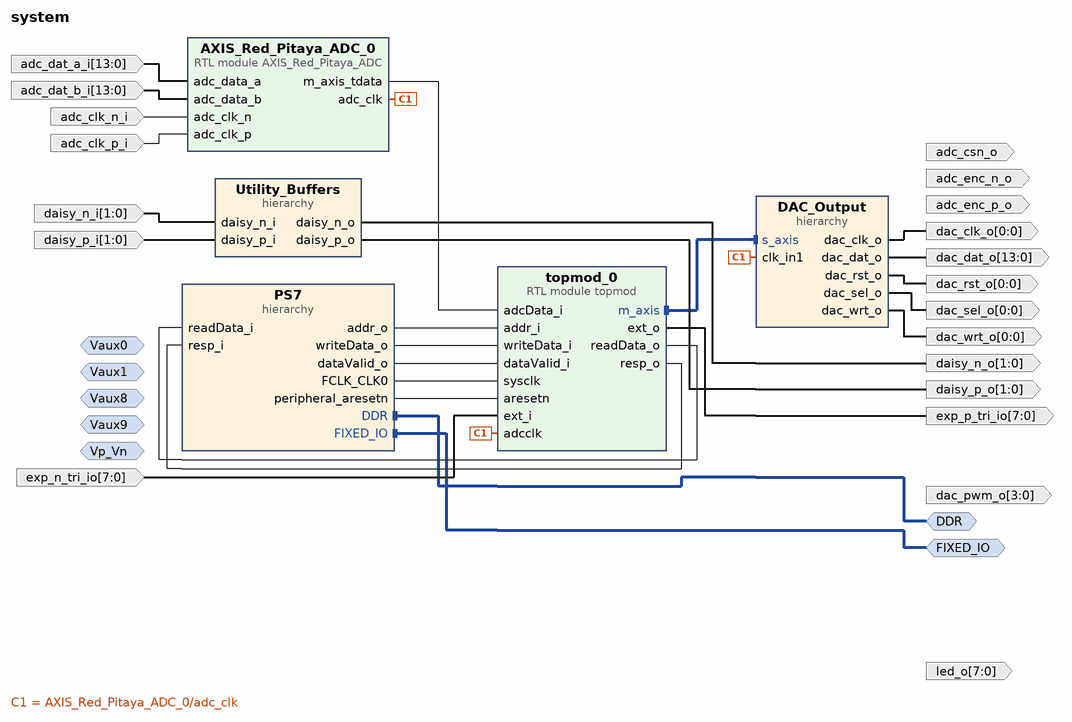
[diagram p0: block diagram of the top level]
# Vivado block design system, xc7z010clg400-1, Vivado 2020.2
create_bd_design system

create_bd_intf_port -mode Slave -vlnv xilinx.com:interface:diff_analog_io_rtl:1.0 Vp_Vn
create_bd_intf_port -mode Slave -vlnv xilinx.com:interface:diff_analog_io_rtl:1.0 Vaux0
create_bd_intf_port -mode Slave -vlnv xilinx.com:interface:diff_analog_io_rtl:1.0 Vaux1
create_bd_intf_port -mode Slave -vlnv xilinx.com:interface:diff_analog_io_rtl:1.0 Vaux9
create_bd_intf_port -mode Slave -vlnv xilinx.com:interface:diff_analog_io_rtl:1.0 Vaux8
create_bd_intf_port -mode Master -vlnv xilinx.com:interface:ddrx_rtl:1.0 DDR
create_bd_intf_port -mode Master -vlnv xilinx.com:display_processing_system7:fixedio_rtl:1.0 FIXED_IO
create_bd_port -dir I -from 13 -to 0 adc_dat_a_i
create_bd_port -dir I -from 13 -to 0 adc_dat_b_i
create_bd_port -dir I adc_clk_p_i
create_bd_port -dir I adc_clk_n_i
create_bd_port -dir O adc_enc_p_o
create_bd_port -dir O adc_enc_n_o
create_bd_port -dir O adc_csn_o
create_bd_port -dir O -from 13 -to 0 dac_dat_o
create_bd_port -dir O -from 0 -to 0 dac_clk_o
create_bd_port -dir O -from 0 -to 0 dac_rst_o
create_bd_port -dir O -from 0 -to 0 dac_sel_o
create_bd_port -dir O -from 0 -to 0 dac_wrt_o
create_bd_port -dir O -from 3 -to 0 dac_pwm_o
create_bd_port -dir O -from 1 -to 0 daisy_p_o
create_bd_port -dir O -from 1 -to 0 daisy_n_o
create_bd_port -dir I -from 1 -to 0 daisy_p_i
create_bd_port -dir I -from 1 -to 0 daisy_n_i
create_bd_port -dir O -from 7 -to 0 led_o
create_bd_port -dir I -from 7 -to 0 exp_n_tri_io
create_bd_port -dir O -from 7 -to 0 exp_p_tri_io

create_bd_cell -type hier Utility_Buffers
create_bd_cell -type hier PS7
create_bd_cell -type hier DAC_Output
create_bd_cell -type module -reference AXIS_Red_Pitaya_ADC AXIS_Red_Pitaya_ADC_0
create_bd_cell -type module -reference topmod topmod_0

# ---- hierarchy /Utility_Buffers ----
current_bd_instance /Utility_Buffers
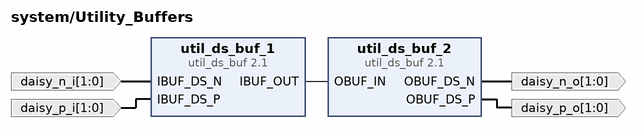
[diagram p1: block diagram inside /Utility_Buffers]
create_bd_pin -dir I -from 1 -to 0 -type clk daisy_n_i
create_bd_pin -dir I -from 1 -to 0 -type clk daisy_p_i
create_bd_pin -dir O -from 1 -to 0 -type clk daisy_n_o
create_bd_pin -dir O -from 1 -to 0 -type clk daisy_p_o

create_bd_cell -type ip -vlnv xilinx.com:ip:util_ds_buf:2.1 util_ds_buf_1
set_property -dict {CONFIG.C_SIZE 2} [get_bd_cells util_ds_buf_1]
create_bd_cell -type ip -vlnv xilinx.com:ip:util_ds_buf:2.1 util_ds_buf_2
set_property -dict {CONFIG.C_BUF_TYPE OBUFDS CONFIG.C_SIZE 2} [get_bd_cells util_ds_buf_2]

# ---- hierarchy /PS7 ----
current_bd_instance /PS7
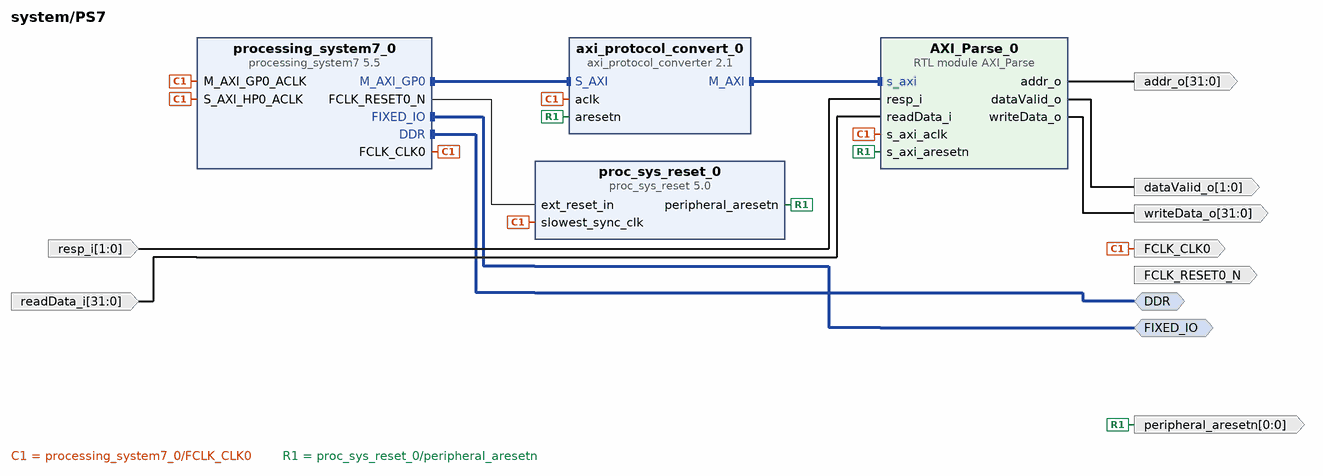
[diagram p2: block diagram inside /PS7]
create_bd_intf_pin -mode Master -vlnv xilinx.com:display_processing_system7:fixedio_rtl:1.0 FIXED_IO
create_bd_intf_pin -mode Master -vlnv xilinx.com:interface:ddrx_rtl:1.0 DDR
create_bd_pin -dir O -type clk FCLK_CLK0
create_bd_pin -dir O -from 31 -to 0 addr_o
create_bd_pin -dir I -from 1 -to 0 resp_i
create_bd_pin -dir O -from 1 -to 0 dataValid_o
create_bd_pin -dir I -from 31 -to 0 readData_i
create_bd_pin -dir O -from 31 -to 0 writeData_o
create_bd_pin -dir O -type rst FCLK_RESET0_N
create_bd_pin -dir O -from 0 -to 0 -type rst peripheral_aresetn

create_bd_cell -type ip -vlnv xilinx.com:ip:processing_system7:5.5 processing_system7_0
set_property -dict [list \
  CONFIG.PCW_APU_PERIPHERAL_FREQMHZ 666.666666 \
  CONFIG.PCW_ENET0_ENET0_IO {MIO 16 .. 27} \
  CONFIG.PCW_ENET0_GRP_MDIO_ENABLE 1 \
  CONFIG.PCW_ENET0_GRP_MDIO_IO EMIO \
  CONFIG.PCW_ENET0_PERIPHERAL_ENABLE 1 \
  CONFIG.PCW_ENET0_RESET_ENABLE 0 \
  CONFIG.PCW_ENET_RESET_ENABLE 1 \
  CONFIG.PCW_ENET_RESET_SELECT {Share reset pin} \
  CONFIG.PCW_FPGA0_PERIPHERAL_FREQMHZ 125 \
  CONFIG.PCW_FPGA1_PERIPHERAL_FREQMHZ 250 \
  CONFIG.PCW_FPGA3_PERIPHERAL_FREQMHZ 200 \
  CONFIG.PCW_GPIO_MIO_GPIO_ENABLE 1 \
  CONFIG.PCW_GPIO_MIO_GPIO_IO MIO \
  CONFIG.PCW_GPIO_PERIPHERAL_ENABLE 1 \
  CONFIG.PCW_I2C0_GRP_INT_ENABLE 0 \
  CONFIG.PCW_I2C0_I2C0_IO {MIO 50 .. 51} \
  CONFIG.PCW_I2C0_PERIPHERAL_ENABLE 1 \
  CONFIG.PCW_I2C_PERIPHERAL_FREQMHZ 111.111115 \
  CONFIG.PCW_I2C_RESET_ENABLE 1 \
  CONFIG.PCW_I2C_RESET_SELECT {Share reset pin} \
  CONFIG.PCW_IMPORT_BOARD_PRESET cfg/red_pitaya.xml \
  CONFIG.PCW_PERIPHERAL_BOARD_PRESET None \
  CONFIG.PCW_PRESET_BANK1_VOLTAGE {LVCMOS 2.5V} \
  CONFIG.PCW_QSPI_GRP_SINGLE_SS_ENABLE 1 \
  CONFIG.PCW_QSPI_GRP_SINGLE_SS_IO {MIO 1 .. 6} \
  CONFIG.PCW_QSPI_PERIPHERAL_ENABLE 1 \
  CONFIG.PCW_QSPI_PERIPHERAL_FREQMHZ 125 \
  CONFIG.PCW_QSPI_QSPI_IO {MIO 1 .. 6} \
  CONFIG.PCW_SD0_GRP_CD_ENABLE 1 \
  CONFIG.PCW_SD0_GRP_CD_IO {MIO 46} \
  CONFIG.PCW_SD0_GRP_WP_ENABLE 1 \
  CONFIG.PCW_SD0_GRP_WP_IO {MIO 47} \
  CONFIG.PCW_SD0_PERIPHERAL_ENABLE 1 \
  CONFIG.PCW_SD0_SD0_IO {MIO 40 .. 45} \
  CONFIG.PCW_SDIO_PERIPHERAL_FREQMHZ 100 \
  CONFIG.PCW_SINGLE_QSPI_DATA_MODE x4 \
  CONFIG.PCW_SPI0_PERIPHERAL_ENABLE 1 \
  CONFIG.PCW_SPI0_SPI0_IO EMIO \
  CONFIG.PCW_SPI1_PERIPHERAL_ENABLE 1 \
  CONFIG.PCW_SPI1_SPI1_IO {MIO 10 .. 15} \
  CONFIG.PCW_TTC0_PERIPHERAL_ENABLE 1 \
  CONFIG.PCW_TTC0_TTC0_IO EMIO \
  CONFIG.PCW_UART0_PERIPHERAL_ENABLE 1 \
  CONFIG.PCW_UART0_UART0_IO {MIO 14 .. 15} \
  CONFIG.PCW_UART1_PERIPHERAL_ENABLE 1 \
  CONFIG.PCW_UART1_UART1_IO {MIO 8 .. 9} \
  CONFIG.PCW_UART_PERIPHERAL_FREQMHZ 100 \
  CONFIG.PCW_UIPARAM_DDR_BUS_WIDTH {16 Bit} \
  CONFIG.PCW_UIPARAM_DDR_FREQ_MHZ 533.333333 \
  CONFIG.PCW_UIPARAM_DDR_PARTNO {MT41J256M16 RE-125} \
  CONFIG.PCW_USB0_PERIPHERAL_ENABLE 1 \
  CONFIG.PCW_USB0_RESET_ENABLE 1 \
  CONFIG.PCW_USB0_RESET_IO {MIO 48} \
  CONFIG.PCW_USB0_USB0_IO {MIO 28 .. 39} \
  CONFIG.PCW_USB_RESET_ENABLE 1 \
  CONFIG.PCW_USB_RESET_SELECT {Share reset pin} \
  CONFIG.PCW_USE_S_AXI_HP0 1 \
  CONFIG.preset None \
] [get_bd_cells processing_system7_0]
# 510 more settings of processing_system7_0 are not shown: defaults, MIO pin electricals, DDR timing, and values the tool derives
create_bd_cell -type ip -vlnv xilinx.com:ip:axi_protocol_converter:2.1 axi_protocol_convert_0
set_property -dict {CONFIG.MI_PROTOCOL AXI4LITE} [get_bd_cells axi_protocol_convert_0]
create_bd_cell -type ip -vlnv xilinx.com:ip:proc_sys_reset:5.0 proc_sys_reset_0
create_bd_cell -type module -reference AXI_Parse AXI_Parse_0

# ---- hierarchy /DAC_Output ----
current_bd_instance /DAC_Output
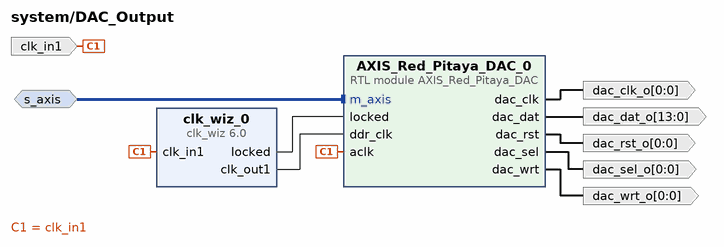
[diagram p3: block diagram inside /DAC_Output]
create_bd_intf_pin -mode Slave -vlnv xilinx.com:interface:axis_rtl:1.0 s_axis
create_bd_pin -dir O -from 0 -to 0 -type clk dac_clk_o
create_bd_pin -dir O -from 0 -to 0 -type rst dac_rst_o
create_bd_pin -dir O -from 0 -to 0 dac_sel_o
create_bd_pin -dir O -from 0 -to 0 dac_wrt_o
create_bd_pin -dir O -from 13 -to 0 dac_dat_o
create_bd_pin -dir I -type clk clk_in1

create_bd_cell -type ip -vlnv xilinx.com:ip:clk_wiz:6.0 clk_wiz_0
set_property -dict [list \
  CONFIG.CLKIN1_JITTER_PS 80.0 \
  CONFIG.CLKOUT1_JITTER 104.759 \
  CONFIG.CLKOUT1_PHASE_ERROR 96.948 \
  CONFIG.CLKOUT1_REQUESTED_OUT_FREQ 250 \
  CONFIG.MMCM_CLKFBOUT_MULT_F 8.000 \
  CONFIG.MMCM_CLKIN1_PERIOD 8.000 \
  CONFIG.MMCM_CLKOUT0_DIVIDE_F 4.000 \
  CONFIG.PRIM_IN_FREQ 125 \
  CONFIG.USE_RESET false \
] [get_bd_cells clk_wiz_0]
create_bd_cell -type module -reference AXIS_Red_Pitaya_DAC AXIS_Red_Pitaya_DAC_0

# ---- connections ----

current_bd_instance /Utility_Buffers
connect_bd_net [get_bd_pins daisy_n_i] [get_bd_pins util_ds_buf_1/IBUF_DS_N]
connect_bd_net [get_bd_pins daisy_p_i] [get_bd_pins util_ds_buf_1/IBUF_DS_P]
connect_bd_net [get_bd_pins util_ds_buf_2/OBUF_DS_N] [get_bd_pins daisy_n_o]
connect_bd_net [get_bd_pins util_ds_buf_2/OBUF_DS_P] [get_bd_pins daisy_p_o]
connect_bd_net [get_bd_pins util_ds_buf_1/IBUF_OUT] [get_bd_pins util_ds_buf_2/OBUF_IN]

current_bd_instance /PS7
connect_bd_intf_net [get_bd_intf_pins axi_protocol_convert_0/M_AXI] [get_bd_intf_pins AXI_Parse_0/s_axi]
connect_bd_intf_net [get_bd_intf_pins FIXED_IO] [get_bd_intf_pins processing_system7_0/FIXED_IO]
connect_bd_intf_net [get_bd_intf_pins processing_system7_0/M_AXI_GP0] [get_bd_intf_pins axi_protocol_convert_0/S_AXI]
connect_bd_intf_net [get_bd_intf_pins DDR] [get_bd_intf_pins processing_system7_0/DDR]
connect_bd_net [get_bd_pins AXI_Parse_0/addr_o] [get_bd_pins addr_o]
connect_bd_net [get_bd_pins AXI_Parse_0/writeData_o] [get_bd_pins writeData_o]
connect_bd_net [get_bd_pins AXI_Parse_0/dataValid_o] [get_bd_pins dataValid_o]
connect_bd_net [get_bd_pins resp_i] [get_bd_pins AXI_Parse_0/resp_i]
connect_bd_net [get_bd_pins readData_i] [get_bd_pins AXI_Parse_0/readData_i]
connect_bd_net [get_bd_pins processing_system7_0/FCLK_CLK0] \
  [get_bd_pins processing_system7_0/S_AXI_HP0_ACLK] [get_bd_pins processing_system7_0/M_AXI_GP0_ACLK] [get_bd_pins FCLK_CLK0] \
  [get_bd_pins axi_protocol_convert_0/aclk] [get_bd_pins proc_sys_reset_0/slowest_sync_clk] \
  [get_bd_pins AXI_Parse_0/s_axi_aclk]
connect_bd_net [get_bd_pins proc_sys_reset_0/peripheral_aresetn] \
  [get_bd_pins peripheral_aresetn] [get_bd_pins axi_protocol_convert_0/aresetn] [get_bd_pins AXI_Parse_0/s_axi_aresetn]
connect_bd_net [get_bd_pins processing_system7_0/FCLK_RESET0_N] [get_bd_pins proc_sys_reset_0/ext_reset_in]

current_bd_instance /DAC_Output
connect_bd_intf_net [get_bd_intf_pins s_axis] [get_bd_intf_pins AXIS_Red_Pitaya_DAC_0/m_axis]
connect_bd_net [get_bd_pins clk_wiz_0/locked] [get_bd_pins AXIS_Red_Pitaya_DAC_0/locked]
connect_bd_net [get_bd_pins clk_wiz_0/clk_out1] [get_bd_pins AXIS_Red_Pitaya_DAC_0/ddr_clk]
connect_bd_net [get_bd_pins AXIS_Red_Pitaya_DAC_0/dac_clk] [get_bd_pins dac_clk_o]
connect_bd_net [get_bd_pins AXIS_Red_Pitaya_DAC_0/dac_rst] [get_bd_pins dac_rst_o]
connect_bd_net [get_bd_pins AXIS_Red_Pitaya_DAC_0/dac_sel] [get_bd_pins dac_sel_o]
connect_bd_net [get_bd_pins AXIS_Red_Pitaya_DAC_0/dac_wrt] [get_bd_pins dac_wrt_o]
connect_bd_net [get_bd_pins AXIS_Red_Pitaya_DAC_0/dac_dat] [get_bd_pins dac_dat_o]
connect_bd_net -net clk_in1_1 [get_bd_pins clk_in1] [get_bd_pins clk_wiz_0/clk_in1] [get_bd_pins AXIS_Red_Pitaya_DAC_0/aclk]

current_bd_instance /
connect_bd_intf_net [get_bd_intf_ports DDR] [get_bd_intf_pins PS7/DDR]
connect_bd_intf_net [get_bd_intf_ports FIXED_IO] [get_bd_intf_pins PS7/FIXED_IO]
connect_bd_intf_net [get_bd_intf_pins topmod_0/m_axis] [get_bd_intf_pins DAC_Output/s_axis]
connect_bd_net [get_bd_ports daisy_n_i] [get_bd_pins Utility_Buffers/daisy_n_i]
connect_bd_net [get_bd_ports daisy_p_i] [get_bd_pins Utility_Buffers/daisy_p_i]
connect_bd_net [get_bd_pins Utility_Buffers/daisy_n_o] [get_bd_ports daisy_n_o]
connect_bd_net [get_bd_pins Utility_Buffers/daisy_p_o] [get_bd_ports daisy_p_o]
connect_bd_net [get_bd_ports adc_dat_a_i] [get_bd_pins AXIS_Red_Pitaya_ADC_0/adc_data_a]
connect_bd_net [get_bd_ports adc_dat_b_i] [get_bd_pins AXIS_Red_Pitaya_ADC_0/adc_data_b]
connect_bd_net [get_bd_pins PS7/addr_o] [get_bd_pins topmod_0/addr_i]
connect_bd_net [get_bd_pins PS7/writeData_o] [get_bd_pins topmod_0/writeData_i]
connect_bd_net [get_bd_pins PS7/dataValid_o] [get_bd_pins topmod_0/dataValid_i]
connect_bd_net [get_bd_pins topmod_0/readData_o] [get_bd_pins PS7/readData_i]
connect_bd_net [get_bd_pins topmod_0/resp_o] [get_bd_pins PS7/resp_i]
connect_bd_net [get_bd_ports adc_clk_n_i] [get_bd_pins AXIS_Red_Pitaya_ADC_0/adc_clk_n]
connect_bd_net [get_bd_ports adc_clk_p_i] [get_bd_pins AXIS_Red_Pitaya_ADC_0/adc_clk_p]
connect_bd_net [get_bd_ports exp_n_tri_io] [get_bd_pins topmod_0/ext_i]
connect_bd_net [get_bd_pins PS7/FCLK_CLK0] [get_bd_pins topmod_0/sysclk]
connect_bd_net [get_bd_pins topmod_0/ext_o] [get_bd_ports exp_p_tri_io]
connect_bd_net [get_bd_pins AXIS_Red_Pitaya_ADC_0/m_axis_tdata] [get_bd_pins topmod_0/adcData_i]
connect_bd_net [get_bd_pins AXIS_Red_Pitaya_ADC_0/adc_clk] [get_bd_pins DAC_Output/clk_in1] [get_bd_pins topmod_0/adcclk]
connect_bd_net [get_bd_pins DAC_Output/dac_clk_o] [get_bd_ports dac_clk_o]
connect_bd_net [get_bd_pins DAC_Output/dac_rst_o] [get_bd_ports dac_rst_o]
connect_bd_net [get_bd_pins DAC_Output/dac_sel_o] [get_bd_ports dac_sel_o]
connect_bd_net [get_bd_pins DAC_Output/dac_wrt_o] [get_bd_ports dac_wrt_o]
connect_bd_net [get_bd_pins DAC_Output/dac_dat_o] [get_bd_ports dac_dat_o]
connect_bd_net [get_bd_pins PS7/peripheral_aresetn] [get_bd_pins topmod_0/aresetn]

# ---- address map ----
assign_bd_address -offset 0x40000000 -range 1G -target_address_space [get_bd_addr_spaces PS7/processing_system7_0/Data] [get_bd_addr_segs PS7/AXI_Parse_0/s_axi/reg0]

validate_bd_design
save_bd_design
